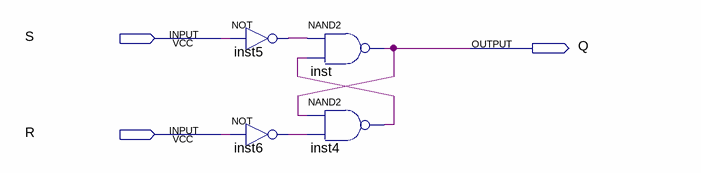
[diagram p0: schematic sheet]
// Quartus schematic latch_SR.bdf as structural Verilog: 4 symbols, 3 pins
module latch_SR (
  input  S,
  input  R,
  output Q
);

  wire inst4_out, inst5_out, inst6_out;

  not inst5 (inst5_out, S);
  not inst6 (inst6_out, R);
  nand inst (Q, inst5_out, inst4_out);
  nand inst4 (inst4_out, Q, inst6_out);
endmodule
